# EAGLE board oresat-card (EAGLE 9.3.0)
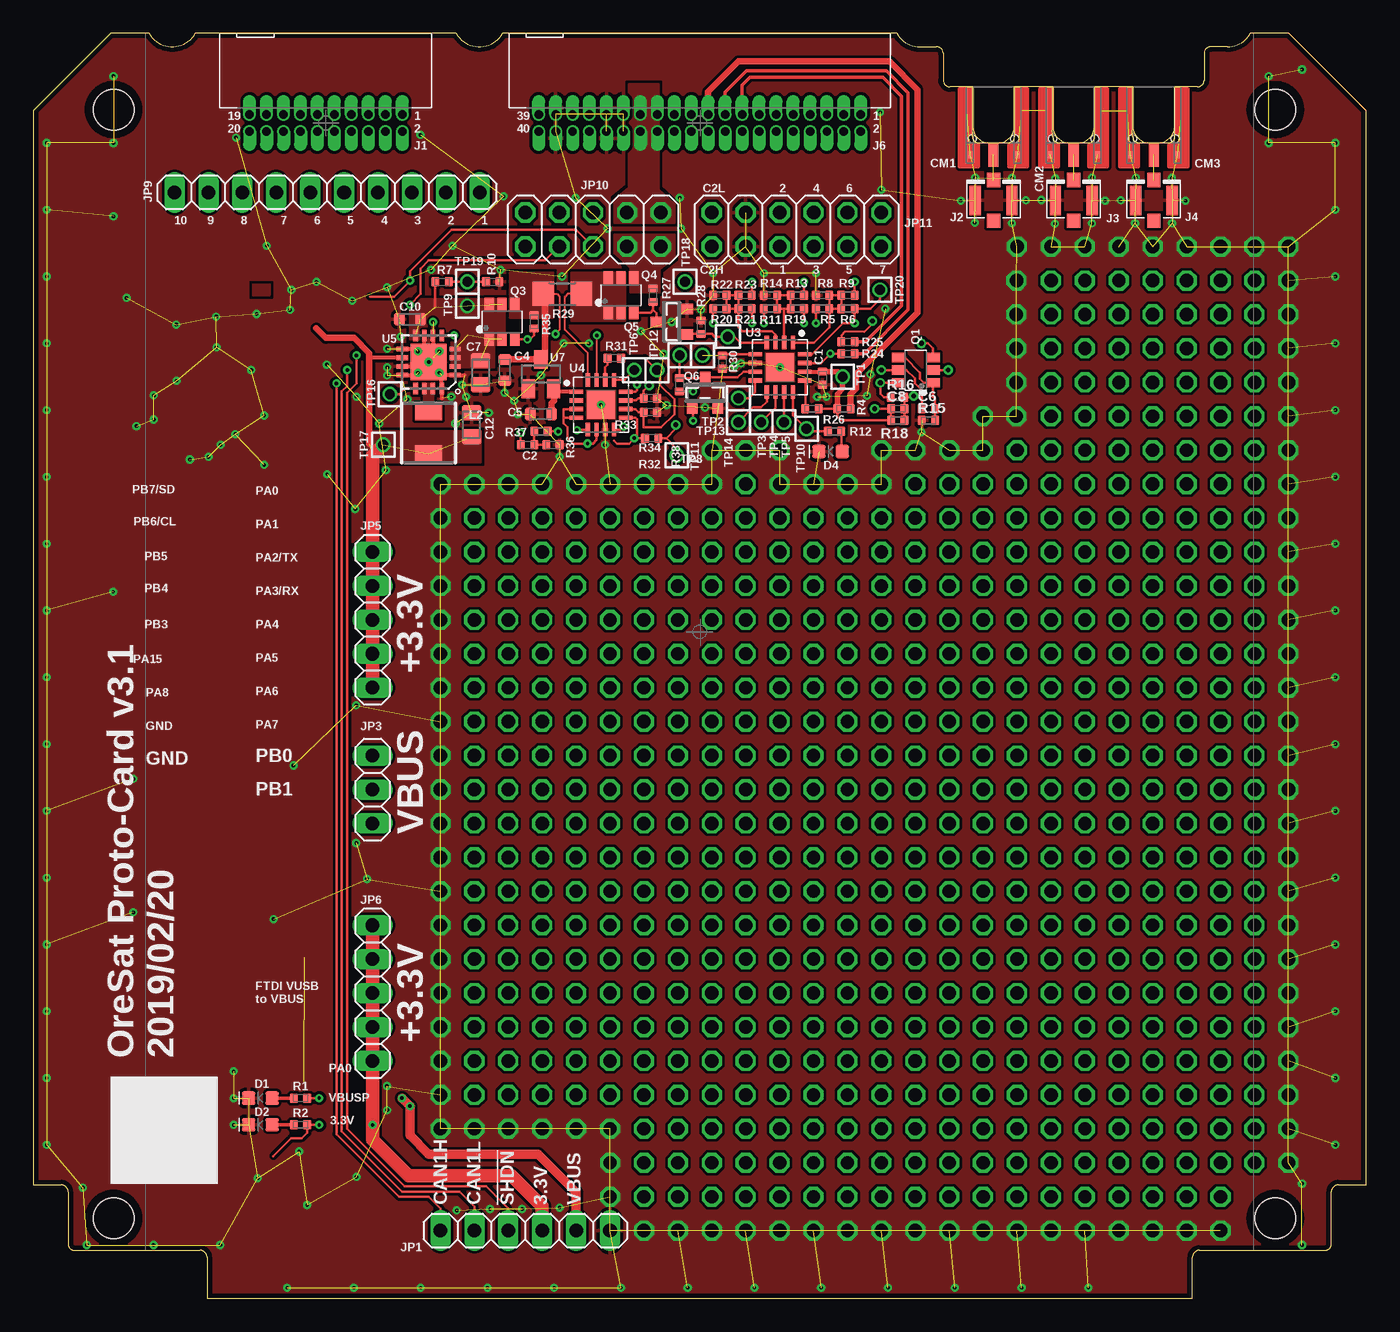
[diagram p2: board, top side]
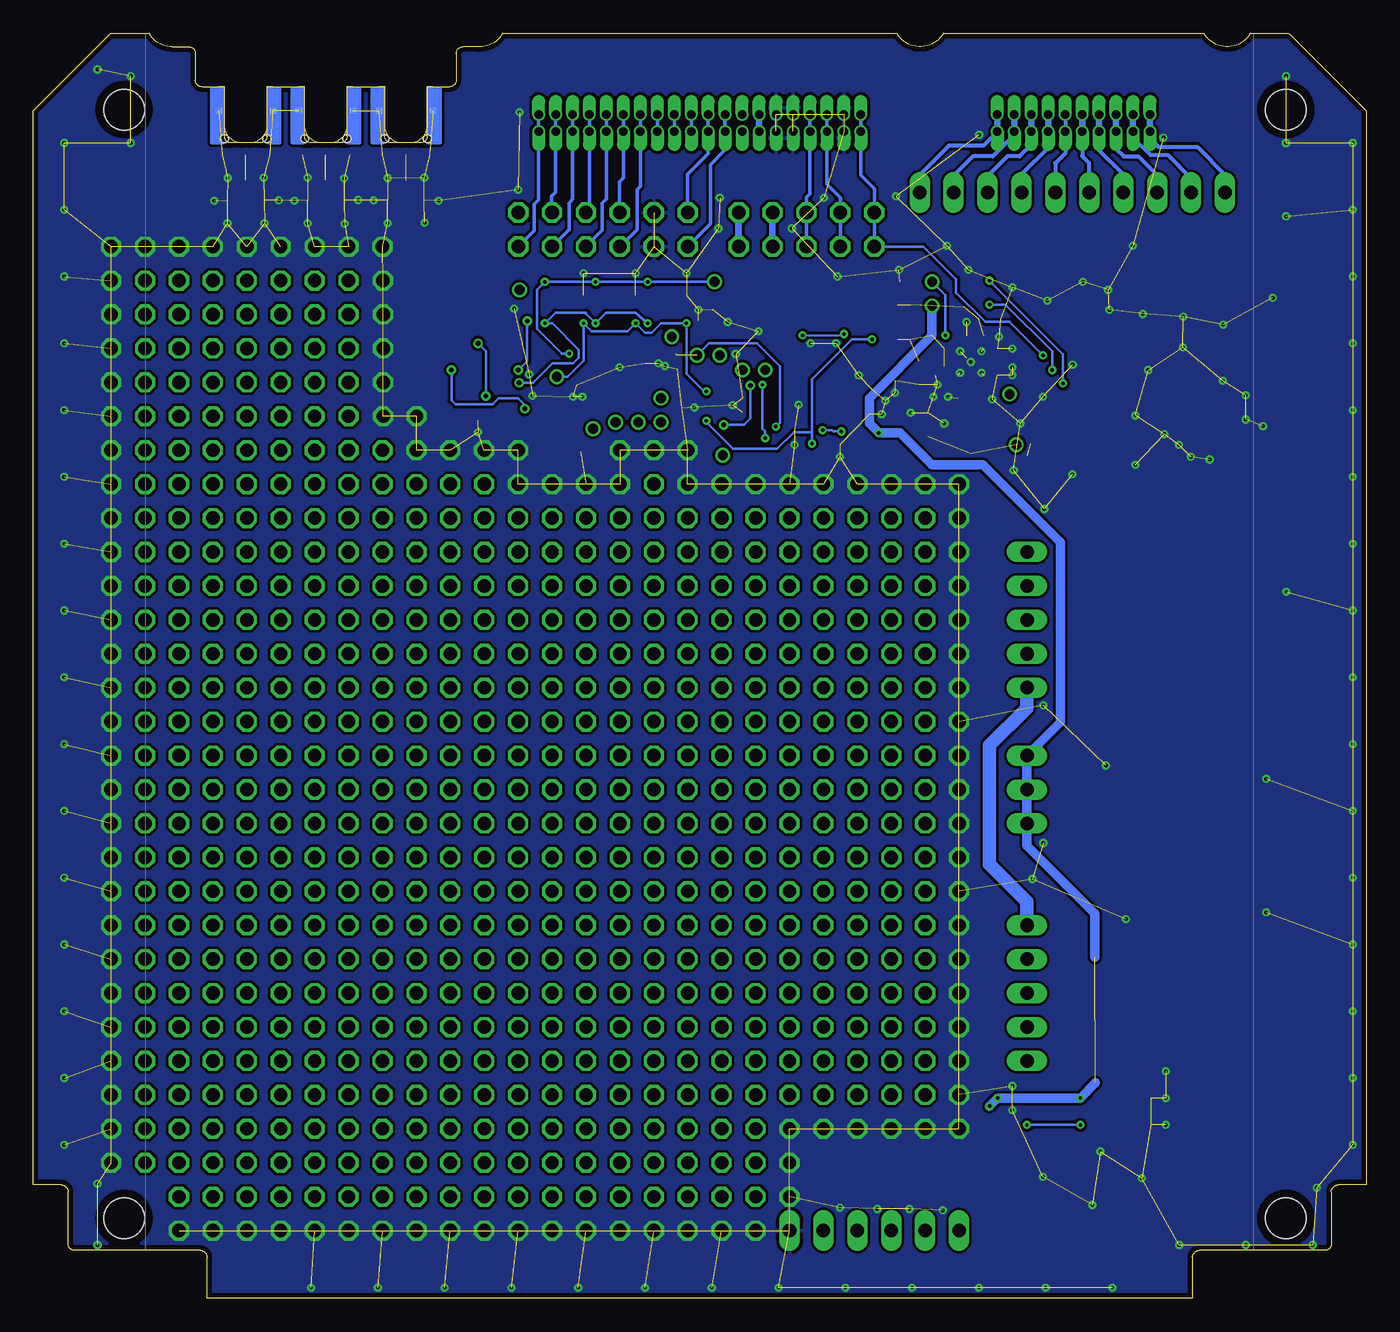
[diagram p3: board, bottom side, seen from below]

Size 99.8 x 94.7 mm. Coordinates in mm from the lower left corner, seen from the top.
Copper layers (1*16): Top 0.0356mm / dielectric 1.5011mm / Bottom 0.0356mm
Design rules "OSH-Park-2-layer *": minimum track width 6mil, minimum drill 10mil, track to track 6mil, track to pad 6mil, pad to pad 6mil, via to via 6mil, smd to smd 6mil, copper to edge 15mil, drill to drill 6mil, minimum pad ring 7mil, minimum via ring 7mil, stop-mask expansion 3mil, vias tented up to drill 13mil, thermal gap 10mil

## Footprints (pad centres in the part's own frame; a part is rotated, then mirrored left to right if it is on the bottom)
.0402-B-NOSILK = smd 0.6 x 0.7: 1 -0.5,0; 2 0.5,0
.0603-B-NOSILK = smd 0.8 x 0.95: 1 -0.8,0; 2 0.8,0
.0805-B-NOSILK = smd 1.15 x 1.45: 1 -0.9,0; 2 0.9,0
J-MOLEX-SMPM-073300-003X = smd 0.508 x 0.508: P$1 -1.778,-5.08; P$2 1.778,-5.08 | smd 0.508 x 0.508 bottom: P$3 -2.032,-1.778; P$4 2.032,-1.778 | smd 0.762 x 1.778: RF 0,-5.08 | hole 0.61: 1.587,-3.886; -1.587,-3.886
LED-0603 = smd 1 x 1: A -0.877,0; C 0.877,0
STAND-OFF-TIGHT = hole 3.048: 0,0
J-SAMTEC-TFM-110-X1-XXX-D-RA = drill 0.635 pad 0.965 offset: 1 5.715,0.635; 2 5.715,-0.635; 3 4.445,0.635; 4 4.445,-0.635; 5 3.175,0.635; 6 3.175,-0.635; 7 1.905,0.635; 8 1.905,-0.635; 9 0.635,0.635; 10 0.635,-0.635; 11 -0.635,0.635; 12 -0.635,-0.635; 13 -1.905,0.635; 14 -1.905,-0.635; 15 -3.175,0.635; 16 -3.175,-0.635; 17 -4.445,0.635; 18 -4.445,-0.635; 19 -5.715,0.635; 20 -5.715,-0.635
U.FL = smd 2.2 x 0.85: 1 0,1.375; 2 0,-1.375 | smd 1.05 x 1: FEED 1.525,0; NC -1.525,0
J-SAMTEC-TFM-120-X1-XXX-D-RA = drill 0.635 pad 0.965 offset: 1 12.065,0.635; 2 12.065,-0.635; 3 10.795,0.635; 4 10.795,-0.635; 5 9.525,0.635; 6 9.525,-0.635; 7 8.255,0.635; 8 8.255,-0.635; 9 6.985,0.635; 10 6.985,-0.635; 11 5.715,0.635; 12 5.715,-0.635; 13 4.445,0.635; 14 4.445,-0.635; 15 3.175,0.635; 16 3.175,-0.635; 17 1.905,0.635; 18 1.905,-0.635; 19 0.635,0.635; 20 0.635,-0.635; 21 -0.635,0.635; 22 -0.635,-0.635; 23 -1.905,0.635; 24 -1.905,-0.635; 25 -3.175,0.635; 26 -3.175,-0.635; 27 -4.445,0.635; 28 -4.445,-0.635; 29 -5.715,0.635; 30 -5.715,-0.635; 31 -6.985,0.635; 32 -6.985,-0.635; 33 -8.255,0.635; 34 -8.255,-0.635; 35 -9.525,0.635; 36 -9.525,-0.635; 37 -10.795,0.635; 38 -10.795,-0.635; 39 -12.065,0.635; 40 -12.065,-0.635
1X06 = drill 1.016 long: 1 -6.35,0; 2 -3.81,0; 3 -1.27,0; 4 1.27,0; 5 3.81,0; 6 6.35,0
1X03 = drill 1.016 long: 1 -2.54,0; 2 0,0; 3 2.54,0
1X05 = drill 1.016 long: 1 -5.08,0; 2 -2.54,0; 3 0,0; 4 2.54,0; 5 5.08,0
1X10 = drill 1.016 long: 1 -11.43,0; 2 -8.89,0; 3 -6.35,0; 4 -3.81,0; 5 -1.27,0; 6 1.27,0; 7 3.81,0; 8 6.35,0; 9 8.89,0; 10 11.43,0
2X05 = drill 1.016 octagon: 1 -5.08,-1.27; 2 -5.08,1.27; 3 -2.54,-1.27; 4 -2.54,1.27; 5 0,-1.27; 6 0,1.27; 7 2.54,-1.27; 8 2.54,1.27; 9 5.08,-1.27; 10 5.08,1.27
2X06 = drill 1.016 octagon: 1 -6.35,-1.27; 2 -6.35,1.27; 3 -3.81,-1.27; 4 -3.81,1.27; 5 -1.27,-1.27; 6 -1.27,1.27; 7 1.27,-1.27; 8 1.27,1.27; 9 3.81,-1.27; 10 3.81,1.27; 11 6.35,-1.27; 12 6.35,1.27
ECS-MPI4040 = smd 2 x 1.3: 1 0,1.575; 2 0,-1.575
SOT23-6 = smd 0.7 x 1: 1 -0.95,-1.3; 2 0,-1.3; 3 0.95,-1.3; 4 0.95,1.3; 5 0,1.3; 6 -0.95,1.3
SOT23 = smd 0.787 x 0.889: 1 -0.953,-1.143; 2 0.953,-1.143; 3 0,1.143
R1206 = smd 1.6 x 1.803: 1 -1.422,0; 2 1.422,0
2MM-TEST-POINT = drill 0.737: 1 0,0
QFN65P400X400X80-17T210 = smd 1.01 x 0.32: 1 -1.86,0.975; 2 -1.86,0.325; 3 -1.86,-0.325; 4 -1.86,-0.975; 9 1.86,-0.975; 10 1.86,-0.325; 11 1.86,0.325; 12 1.86,0.975 | smd 0.32 x 1.01: 5 -0.975,-1.86; 6 -0.325,-1.86; 7 0.325,-1.86; 8 0.975,-1.86; 13 0.975,1.86; 14 0.325,1.86; 15 -0.325,1.86; 16 -0.975,1.86 | smd 2.1 x 2.1: EPAD 0,0
S-PVQFN-16 = smd 0.85 x 0.35: 1 -1.975,0.975; 2 -1.975,0.325; 3 -1.975,-0.325; 4 -1.975,-0.975; 9 1.975,-0.975; 10 1.975,-0.325; 11 1.975,0.325; 12 1.975,0.975 | smd 0.35 x 0.85: 5 -0.975,-1.975; 6 -0.325,-1.975; 7 0.325,-1.975; 8 0.975,-1.975; 13 0.975,1.975; 14 0.325,1.975; 15 -0.325,1.975; 16 -0.975,1.975 | smd 2.7 x 2.7: PAD 0,0
SOT23' = smd 1 x 1.4: 1 -0.95,-1.1; 2 0.95,-1.1; 3 0,1.1

## Placement (x,y rotation side)
C1  100n  [.0402-B-NOSILK]  59.1,68.9 90 top
C2  NP  [.0402-B-NOSILK]  37,63.9 180 top
C4  1u  [.0603-B-NOSILK]  35.3,69.5 270 top
C5  1u  [.0603-B-NOSILK]  38,66.2 180 top
C6  TBD  [.0402-B-NOSILK]  67.03,66.6 0 top
C7  10u  [.0805-B-NOSILK]  33.5,69.3 270 top
C8  TBD  [.0402-B-NOSILK]  64.72,66.6 0 top
C10  1u  [.0603-B-NOSILK]  28.2,73.3 180 top
C12  22u  [.0805-B-NOSILK]  32.8,65.4 90 top
CM1  J-MOLEX-SMPM-73300-003X  [J-MOLEX-SMPM-073300-003X]  71.9,90.7 0 top
CM2  J-MOLEX-SMPM-73300-003X  [J-MOLEX-SMPM-073300-003X]  77.9,90.7 0 top
CM3  J-MOLEX-SMPM-73300-003X  [J-MOLEX-SMPM-073300-003X]  83.9,90.7 0 top
D1  GREEN  [LED-0603]  17,15 180 top
D2  GREEN  [LED-0603]  17,13 180 top
D4  AMBER  [LED-0603]  59.7,63.4 180 top
H1  STAND-OFFTIGHT  [STAND-OFF-TIGHT]  93,6 0 top
H2  STAND-OFFTIGHT  [STAND-OFF-TIGHT]  93,89 0 top
H3  STAND-OFFTIGHT  [STAND-OFF-TIGHT]  6,89 0 top
H4  STAND-OFFTIGHT  [STAND-OFF-TIGHT]  6,6 0 top
J1  J-SAMTEC-TFM-110-X1-XXX-D-RA  [J-SAMTEC-TFM-110-X1-XXX-D-RA]  21.9,87.99 0 top
J2  U.FL  [U.FL]  71.9,82.2 90 top
J3  U.FL  [U.FL]  77.9,82.2 90 top
J4  U.FL  [U.FL]  83.9,82.2 90 top
J6  J-SAMTEC-TFM-120-X1-XXX-D-RA  [J-SAMTEC-TFM-120-X1-XXX-D-RA]  49.9,87.99 0 top
JP1  [1X06]  36.83,5.08 0 top
JP3  [1X03]  25.4,38.1 90 top
JP5  [1X05]  25.4,50.8 270 top
JP6  [1X05]  25.4,22.86 90 top
JP9  [1X10]  22,82.8 180 top
JP10  [2X05]  41.91,80.01 180 top
JP11  [2X06]  57.15,80.01 180 top
L2  6.8u  [ECS-MPI4040]  29.6,64.8 0 top
Q1  DMP2240UDM  [SOT23-6]  66.08,69.5 90 top
Q3  MOSFET-PCH-SOT23-6  [SOT23-6]  35.1,73.1 0 top
Q4  MOSFET-PCH-SOT23-6  [SOT23-6]  44,75.1 0 top
Q5  PMV45EN  [SOT23]  47.8,73.1 90 top
Q6  PMV45EN  [SOT23]  50.3,67.8 0 top
R1  2.7k  [.0402-B-NOSILK]  20,15 0 top
R2  2.7k  [.0402-B-NOSILK]  20,13 0 top
R4  100  [.0402-B-NOSILK]  60.7,66.6 180 top
R5  NP  [.0402-B-NOSILK]  59.1,74.1 180 top
R6  NP  [.0402-B-NOSILK]  61,75.1 180 top
R7  10k  [.0402-B-NOSILK]  30.6,76.1 180 top
R8  NP  [.0402-B-NOSILK]  59.1,75.1 0 top
R9  NP  [.0402-B-NOSILK]  61,74.1 0 top
R10  NP  [.0402-B-NOSILK]  34.4,76.1 180 top
R11  NP  [.0402-B-NOSILK]  55.2,74.1 180 top
R12  2.7k  [.0402-B-NOSILK]  60,64.9 180 top
R13  NP  [.0402-B-NOSILK]  57.2,75.1 180 top
R14  NP  [.0402-B-NOSILK]  55.2,75.1 0 top
R15  10k  [.0402-B-NOSILK]  67.03,65.72 0 top
R16  10k  [.0402-B-NOSILK]  64.7,67.47 0 top
R18  10k  [.0402-B-NOSILK]  64.72,65.72 180 top
R19  NP  [.0402-B-NOSILK]  57.2,74.1 0 top
R20  NP  [.0402-B-NOSILK]  51.4,74.1 180 top
R21  NP  [.0402-B-NOSILK]  53.3,75.1 180 top
R22  NP  [.0402-B-NOSILK]  51.4,75.1 0 top
R23  NP  [.0402-B-NOSILK]  53.3,74.1 0 top
R24  100  [.0402-B-NOSILK]  61,70.72 180 top
R25  100  [.0402-B-NOSILK]  61,71.6 180 top
R26  10k  [.0402-B-NOSILK]  58.3,66.6 0 top
R27  10k  [.0402-B-NOSILK]  46.4,75.1 90 top
R28  10k  [.0402-B-NOSILK]  50,72.7 270 top
R29  100m  [R1206]  39.6,75.2 180 top
R30  10k  [.0402-B-NOSILK]  51.6,70.1 90 top
R31  0  [.0402-B-NOSILK]  43.5,70.4 180 top
R32  NP  [.0402-B-NOSILK]  46.2,66.35 180 top
R33  0  [.0402-B-NOSILK]  46.3,64.4 180 top
R34  NP  [.0402-B-NOSILK]  46.2,67.4 180 top
R35  10k  [.0402-B-NOSILK]  37.5,73.1 90 top
R36  NP  [.0402-B-NOSILK]  38.9,63.9 180 top
R37  NP  [.0402-B-NOSILK]  38,64.9 180 top
R38  10k  [.0402-B-NOSILK]  48.4,68.4 270 top
TP1  TEST-POINT  [2MM-TEST-POINT]  60.6,69 0 top
TP2  TEST-POINT  [2MM-TEST-POINT]  52.8,67.4 0 top
TP3  TEST-POINT  [2MM-TEST-POINT]  52.8,65.6 0 top
TP4  TEST-POINT  [2MM-TEST-POINT]  54.5,65.6 0 top
TP5  TEST-POINT  [2MM-TEST-POINT]  56.2,65.6 0 top
TP6  TEST-POINT  [2MM-TEST-POINT]  45,69.5 0 top
TP8  TEST-POINT  [2MM-TEST-POINT]  48.4,70.6 0 top
TP9  TEST-POINT  [2MM-TEST-POINT]  32.5,74.3 0 top
TP10  TEST-POINT  [2MM-TEST-POINT]  57.9,65.1 0 top
TP11  TEST-POINT  [2MM-TEST-POINT]  48.17,63.13 0 top
TP12  TEST-POINT  [2MM-TEST-POINT]  46.7,69.5 0 top
TP13  TEST-POINT  [2MM-TEST-POINT]  52,72 90 top
TP14  TEST-POINT  [2MM-TEST-POINT]  50.1,70.6 0 top
TP16  TEST-POINT  [2MM-TEST-POINT]  26.7,67.7 180 top
TP17  TEST-POINT  [2MM-TEST-POINT]  26.2,63.9 180 top
TP18  TEST-POINT  [2MM-TEST-POINT]  48.8,76.1 0 top
TP19  TEST-POINT  [2MM-TEST-POINT]  32.5,76.1 0 top
TP20  TEST-POINT  [2MM-TEST-POINT]  63.4,75.5 0 top
U3  MAX7310ATE  [QFN65P400X400X80-17T210]  55.9,69.7 270 top
U4  MAX4211CETE  [QFN65P400X400X80-17T210]  42.5,66.9 0 top
U5  TPS62111RSA  [S-PVQFN-16]  29.6,70.1 180 top
U7  MCP1703A  [SOT23']  38,69.2 0 top
U$1  ORESAT-CARD-V1.1-3XRF  [ORESAT-CARD-V1.1-3XRF]  0,0 0 top

## Tracks (layer width: path | path; a pad name or v marks a point on that pad's centre or on a via)
3.3V  (via drill 0.25)  (3 unrouted)
  Top 0.2: v21.4,13 R2.2 20.5,12.4 20.1,12 19.3,12 17.96,10.66
  Top 0.3: U5.10 25.18,70.42 25.15,70.5
  Top 0.5: 21.18,72.62 21.9,71.9 24,71.9 25.15,70.75 25.15,70.5 25.15,64
  Top 1: JP5.5 JP5.4 JP5.3 JP5.2 JP5.1 25.4,63.1 TP17.1 | JP6.5 JP6.4 JP6.3 JP6.2 JP6.1 v25.4,13 25.4,11.9 28.1,9.2 35.8,9.2 38.1,6.9 JP1.4
  Bottom 0.2: v21.4,13 v25.4,13
  Bottom 1: JP5.5 25.4,44.2 28.2,41.4 28.2,32.5 25.4,29.7 JP6.5
  pour Top (no thermals): 16.42,75.9 16.42,75.1 17.72,75.1 17.72,75.9
  pour Top (no thermals): 25,64.9 33.5,64.9 33.5,62.6 25,62.6
!FAULT
  Top 0.2: U3.7 53.17,69.38 52.74,68.94 Q6.3 50.26,68.9 R38.1 TP8.1
!SHUTDOWN  (via drill 0.25)
  Top 0.2: v24.2,70.6 24.2,68.5 23.5,67.8 23.5,12.7 27.8,8.4 33.9,8.4 35.56,6.74 JP1.3
  Bottom 0.2: v24.2,70.6 26.7,73.1 28.5,73.1 30.7,75.3 30.7,76.3 33.14,78.74 JP10.10
  Bottom 0.25: J6.39 J6.40 37.84,84.06 36.83,83.06 JP10.9 JP10.10
AD0
  Top 0.2: U3.1 58.46,71.56 59.6,72.7 R5.1 | R5.1 R9.1 R6.2 R8.2 R5.1
AD1
  Top 0.2: U3.2 56.23,72.44 56.2,72.47 56.2,74.1 | 56.2,74.1 R11.1 R14.2 R13.2 R19.1 56.2,74.1
AD2
  Top 0.2: U3.3 55.58,72.12 55.3,72.4 53.1,72.4 52.8,72.7 R23.1 | R23.1 R21.2 R22.2 R20.1 R23.1
AUX_!SHUTDOWN
  Bottom 0.3: J1.20 16.18,86.83 15.55,86.2 12.65,86.2 10.55,84.1 10.57,84.08 JP9.10
  Bottom 0.5: J1.20 J1.19
AUX_CAN1_H
  Bottom 0.3: J1.14 20,85.94 18.19,84.14 JP9.7
  Bottom 0.5: J1.14 J1.13
AUX_CAN1_L
  Bottom 0.3: J1.16 18.73,86.08 18.15,85.5 17.05,85.5 15.65,84.1 JP9.8
  Bottom 0.5: J1.16 J1.15
AUX_CAN2_H
  Bottom 0.3: J1.2 27.61,87.33 28.65,86.3 31.25,86.3 33.45,84.1 33.45,83.32 JP9.1
  Bottom 0.5: J1.2 J1.1
AUX_CAN2_L
  Bottom 0.3: J1.4 26.34,87.11 27.95,85.5 29.45,85.5 30.95,84 30.89,83.94 JP9.2
  Bottom 0.5: J1.4 J1.3
AUX_GND1
  Bottom 0.3: J1.18 17.45,86.91 16.15,85.6 14.85,85.6 13.11,83.86 JP9.9
  Bottom 0.5: J1.18 J1.17
AUX_GND2
  Bottom 0.3: J1.12 21.27,85.52 20.75,85 20.75,83.32 JP9.6
  Bottom 0.5: J1.12 J1.11
AUX_GND3
  Bottom 0.3: JP9.5 23.27,84.98 22.54,85.72 J1.10 J1.9
AUX_VBUS1
  Bottom 0.3: J1.8 23.8,86.14 25.81,84.14 JP9.4
  Bottom 0.5: J1.8 J1.7
AUX_VBUS2
  Bottom 0.3: J1.6 25.07,86.38 25.95,85.5 26.85,85.5 28.35,84 JP9.3
  Bottom 0.5: J1.6 J1.5
CAN1_H  (via drill 0.25)
  Top 0.2: JP10.6 40.65,80 31.3,80 28.2,76.9 v28.2,76.2 27,75 25.2,75 | JP1.1 30.5,5.1 30.5,6.7 29.6,7.6 27.4,7.6 22.7,12.3 v22.7,68.5
  Bottom 0.2: v28.2,76.2 22.7,70.7 v22.7,68.5
  Bottom 0.25: J6.33 J6.34 41.65,82.69 41.9,82.43 JP10.5 JP10.6
CAN1_L  (via drill 0.25)
  Top 0.2: JP10.8 38.33,77.7 29.6,77.7 29,77.1 29,75.2 v28.2,74.4 28.18,74.38 | v23.5,69.5 23.5,68.3 23.1,67.9 23.1,12.5 27.6,8 31.9,8 33.02,6.88 JP1.2
  Bottom 0.2: v28.2,74.4 27,74.4 23.5,70.9 v23.5,69.5
  Bottom 0.25: J6.35 J6.36 40.38,83.41 39.37,82.4 JP10.7 JP10.8
CAN2_H
  Bottom 0.25: J6.21 J6.22 49.27,85.7 50.8,84.17 JP11.11
CAN2_L
  Bottom 0.25: J6.23 J6.24 47.99,85.97 49.1,84.87 49.1,80.44 JP11.12
CB-RESET  (via drill 0.25)  (2 unrouted)
  Top 0.2: U3.5 51.67,70.67 | v44.2,65.26 43.98,65.04 U4.8
  Bottom 0.2: v44.2,65.26 43.9,65.56 43.9,69.8 45.6,71.5 49.2,71.5 TP14.1
CB_CTRL  (via drill 0.25)
  Top 0.2: R35.1 37.5,72.1 37.2,71.8 v37,71.8 Q3.3 | U4.6 42.17,64.28 41.9,64 v41.5,64 40.4,64 40,64.4 40,65.22 39.7,65.53 39.7,65.92 | U4.4 39.7,65.92 | U4.3 39.7,66.58 39.7,65.92 | v49.4,65.7 49.4,66.61 Q6.1
  Bottom 0.2: v41.5,64 41.5,64.9 | 41.5,64.9 41.5,68.8 38.5,71.8 v37,71.8 | v49.4,65.7 49.4,65.6 47.4,63.6 44.1,63.6 42.85,64.85 41.55,64.85 41.5,64.9
GND  (via drill 0.25, 1)  (336 unrouted)
  Top 0.3: 30.57,69.12 U5.16 30.57,67.38 | 30.57,69.12 U5.1 32.27,69.12 | 30.57,69.12 U5.PAD | U5.6 29.93,70.42 U5.PAD | U5.7 29.27,70.42 U5.PAD | U5.9 28.62,71.08 U5.PAD | U5.11 29.27,69.78 U5.PAD | U5.12 28.62,69.12 U5.PAD
  other vias: 13.72,71.2 21.2,76.1 16.32,69.5 19.32,75.5 7.72,65.3 4,4 23.88,74.7 97.5,11.5 1,11.5 1,16.5 1,21.5 1,26.5 1,31.5 1,36.5 1,41.5 1,46.5 1,51.5 1,56.5 1,61.5 1,66.5 1,71.5 1,76.5 1,81.5 1,86.5 6,86.5 6,91.5 97.5,16.5 97.5,21.5 97.5,26.5 97.5,31.5 97.5,36.5 97.5,41.5 97.5,46.5 97.5,51.5 97.5,56.5 97.5,61.5 97.5,66.5 97.5,71.5 97.5,76.5 97.5,81.5 97.5,86.5 92.5,86.5 92.5,91.5 30.48,53.34 30.48,55.88 30.48,48.26 30.48,45.72 30.48,43.18 30.48,40.64 30.48,38.1 30.48,35.56 30.48,33.02 30.48,30.48 30.48,27.94 30.48,25.4 30.48,22.86 30.48,20.32 30.48,17.78 30.48,15.24 30.48,12.7 33.02,12.7 53.34,5.08 55.88,5.08 58.42,5.08 60.96,5.08 63.5,5.08 66.04,5.08 68.58,5.08 71.12,5.08 73.66,5.08 76.2,5.08 78.74,5.08 81.28,5.08 83.82,5.08 86.36,5.08 88.9,5.08 19.22,74 15.12,64.7 14.02,63.9 13.12,63 11.72,62.8 9.02,65.8 9.02,67.6 10.72,68.7 16.72,73.7 95,8.6 95,4 3.7,8.3 9,4 93.98,50.8 93.98,48.26 93.98,45.72 93.98,43.18 93.98,40.64 93.98,38.1 93.98,35.56 93.98,33.02 93.98,30.48 93.98,27.94 93.98,25.4 93.98,22.86 93.98,20.32 93.98,17.78 93.98,15.24 93.98,12.7 93.98,10.16 35.56,12.7 30.48,50.8 14,4 19,0.8 24,0.8 29,0.8 39,0.8 44,0.8 49,0.8 54,0.8 59,0.8 64,0.8 69,0.8 74,0.8 13.7,73.5 10.7,72.9 93.98,53.34 93.98,55.88 93.98,58.42 93.98,60.96 93.98,63.5 93.98,66.04 93.98,68.58 93.98,71.12 93.98,73.66 93.98,76.2 93.98,78.74 91.44,78.74 88.9,78.74 86.36,78.74 83.82,78.74 81.28,78.74 78.74,78.74 76.2,78.74 73.66,78.74 50.8,63.5 38.1,12.7 40.64,12.7 45.72,5.08 48.26,5.08 50.8,5.08 45.72,60.96 43.18,60.96 40.64,60.96 38.1,60.96 43.18,12.7 43.18,10.16 43.18,7.62 21.98,69.9 6.98,74.9 5.98,52.9 19.48,39.9 7.48,38.9 7.48,28.9 17.98,28.4 24.98,31.4 16.8,9 19.9,11 26.5,14.1 26.5,69.1 26.5,69.7 27.5,72 26.5,71.1 29.6,70.1 30.4,69.3 28.8,69.3 28.8,70.9 30.4,70.9 32.1,68.4 31.3,67.5 32.4,67.5 34.1,66.3 53,70 55.9,69.7 58.7,67.5 59.4,67.5 35.28,67.8 36.28,66.2 39.4,63 42.5,66.9 42.8,63.9 50.3,66.7 47.42,66.88 47.8,73.1 50,74 52.5,69.8 45.5,72.4 47.2,70.7 34.98,77 28,67.3 35.56,60.96 33.02,60.96 30.48,60.96 30.48,58.42 39.6,76.5 40.6,82.4 35.2,82.5 43,80.1 48.5,80.1 48.4,82.4 63.4,88.8 63.8,74.1 63.5,83 41.6,71.5 39.7,71.5 38,69.1 36,67.2 31.6,65.5 25.9,65.5 26.4,62 24.2,67.5 24.1,59.1 22,61.7 17.28,66.1 17.28,62.4 24.18,44.4 24.18,34.1 26.48,15.9 39.4,6.8 36.6,6.7 34.2,6.7 31.7,6.6 34,0.8 79,0.8 95,92 29.78,77 31.38,78.8 26.48,75.7 17.48,78.8 15.18,86.9 28.98,87.1 6,81 20.5,7 15,13 15,15 15,17 24.2,9.1 48.26,60.96 53.34,63.5 66.5,64.85 62.67,69.17 62.42,67.58 73.62,76.2 73.61,66.04 73.61,68.58 73.61,71.12 73.61,73.66 55.88,63.5 55.88,60.96 58.42,60.96 60.96,60.96 63.5,60.96 63.5,63.5 66.04,63.5 50.8,60.96 68.58,63.5 71.11,66.04 71.12,63.5 50.9,76.75 54.7,76.75 58.6,76.75 29.93,73.1 86.28,82.17 85.28,80.47 85.25,83.88 82.55,83.9 81.42,82.2 82.5,80.47 80.25,82.17 79.28,83.9 79.28,80.47 76.5,80.45 75.47,82.22 76.53,83.85 73.28,83.88 74.33,82.2 73.28,80.5 70.5,80.53 69.45,82.17 70.53,83.9
  pour Top (isolate 0.2, rank 6): 0,0 101,0 101,95.3 0,95.3
  pour Bottom (isolate 0.2, rank 6): 0,0 100,0 100,95 0,95
MAX4211-3V3
  Top 0.3: U4.1 39.17,67.88 U7.2
  Top 0.5: C5.1 38.8,67 39,67.2 39,68.05 U7.2
N$2  (via drill 1)
  other vias: 38.1,50.8
N$3  (via drill 1)
  other vias: 40.64,50.8
N$4  (via drill 1)
  other vias: 50.8,7.62
N$5  (via drill 1)
  other vias: 53.34,7.62
N$6  (via drill 1)
  other vias: 55.88,7.62
N$7  (via drill 1)
  other vias: 58.42,7.62
N$8  (via drill 1)
  other vias: 60.96,7.62
N$9  (via drill 1)
  other vias: 43.18,50.8
N$10  (via drill 1)
  other vias: 50.8,10.16
N$11  (via drill 1)
  other vias: 53.34,10.16
N$12  (via drill 1)
  other vias: 55.88,10.16
N$13  (via drill 1)
  other vias: 45.72,50.8
N$14  (via drill 1)
  other vias: 48.26,50.8
N$15  (via drill 1)
  other vias: 50.8,12.7
N$16  (via drill 1)
  other vias: 53.34,12.7
N$17  (via drill 1)
  other vias: 38.1,48.26
N$18  (via drill 1)
  other vias: 50.8,15.24
N$19  (via drill 1)
  other vias: 40.64,48.26
N$20  (via drill 1)
  other vias: 43.18,48.26
N$21  (via drill 1)
  other vias: 45.72,48.26
N$22  (via drill 1)
  other vias: 48.26,48.26
N$23  (via drill 1)
  other vias: 38.1,45.72
N$24  (via drill 1)
  other vias: 40.64,45.72
N$25  (via drill 1)
  other vias: 43.18,45.72
N$26  (via drill 1)
  other vias: 45.72,45.72
N$27  (via drill 1)
  other vias: 48.26,45.72
N$28  (via drill 1)
  other vias: 38.1,43.18
N$29  (via drill 1)
  other vias: 40.64,43.18
N$30  (via drill 1)
  other vias: 43.18,43.18
N$31  (via drill 1)
  other vias: 45.72,43.18
N$32  (via drill 1)
  other vias: 81.28,50.8
N$33  (via drill 1)
  other vias: 81.28,48.26
N$34  (via drill 1)
  other vias: 81.28,45.72
N$35  (via drill 1)
  other vias: 81.28,43.18
N$36  (via drill 1)
  other vias: 81.28,40.64
N$37  (via drill 1)
  other vias: 81.28,38.1
N$38  (via drill 1)
  other vias: 48.26,43.18
N$39  (via drill 1)
  other vias: 38.1,40.64
N$40  (via drill 1)
  other vias: 40.64,40.64
N$41  (via drill 1)
  other vias: 43.18,40.64
N$42  (via drill 1)
  other vias: 45.72,40.64
N$43  (via drill 1)
  other vias: 48.26,40.64
N$44  (via drill 1)
  other vias: 38.1,38.1
N$45  (via drill 1)
  other vias: 40.64,38.1
N$46  (via drill 1)
  other vias: 43.18,38.1
N$47  (via drill 1)
  other vias: 45.72,38.1
N$48  (via drill 1)
  other vias: 48.26,38.1
N$49  (via drill 1)
  other vias: 38.1,35.56
N$50  (via drill 1)
  other vias: 40.64,35.56
N$51  (via drill 1)
  other vias: 43.18,35.56
N$52  (via drill 1)
  other vias: 50.8,50.8
N$53  (via drill 1)
  other vias: 53.34,50.8
N$54  (via drill 1)
  other vias: 55.88,50.8
N$55  (via drill 1)
  other vias: 58.42,50.8
N$56  (via drill 1)
  other vias: 60.96,50.8
N$57  (via drill 1)
  other vias: 63.5,50.8
N$58  (via drill 1)
  other vias: 66.04,50.8
N$59  (via drill 1)
  other vias: 68.58,50.8
N$60  (via drill 1)
  other vias: 71.12,50.8
N$61  (via drill 1)
  other vias: 73.66,50.8
N$62  (via drill 1)
  other vias: 76.2,50.8
N$63  (via drill 1)
  other vias: 78.74,50.8
N$64  (via drill 1)
  other vias: 45.72,35.56
N$65  (via drill 1)
  other vias: 50.8,48.26
N$66  (via drill 1)
  other vias: 53.34,48.26
N$67  (via drill 1)
  other vias: 55.88,48.26
N$68  (via drill 1)
  other vias: 58.42,48.26
N$69  (via drill 1)
  other vias: 60.96,48.26
N$70  (via drill 1)
  other vias: 63.5,48.26
N$71  (via drill 1)
  other vias: 66.04,48.26
N$72  (via drill 1)
  other vias: 68.58,48.26
N$73  (via drill 1)
  other vias: 71.12,48.26
N$74  (via drill 1)
  other vias: 73.66,48.26
N$75  (via drill 1)
  other vias: 76.2,48.26
N$76  (via drill 1)
  other vias: 78.74,48.26
N$77  (via drill 1)
  other vias: 48.26,35.56
N$78  (via drill 1)
  other vias: 50.8,45.72
N$79  (via drill 1)
  other vias: 53.34,45.72
N$80  (via drill 1)
  other vias: 55.88,45.72
N$81  (via drill 1)
  other vias: 58.42,45.72
N$82  (via drill 1)
  other vias: 60.96,45.72
N$83  (via drill 1)
  other vias: 63.5,45.72
N$84  (via drill 1)
  other vias: 66.04,45.72
N$85  (via drill 1)
  other vias: 68.58,45.72
N$86  (via drill 1)
  other vias: 71.12,45.72
N$87  (via drill 1)
  other vias: 73.66,45.72
N$88  (via drill 1)
  other vias: 76.2,45.72
N$89  (via drill 1)
  other vias: 78.74,45.72
N$90  (via drill 1)
  other vias: 38.1,33.02
N$91  (via drill 1)
  other vias: 50.8,43.18
N$92  (via drill 1)
  other vias: 53.34,43.18
N$93  (via drill 1)
  other vias: 55.88,43.18
N$94  (via drill 1)
  other vias: 58.42,43.18
N$95  (via drill 1)
  other vias: 60.96,43.18
N$96  (via drill 1)
  other vias: 63.5,43.18
N$97  (via drill 1)
  other vias: 66.04,43.18
N$98  (via drill 1)
  other vias: 68.58,43.18
N$99  (via drill 1)
  other vias: 71.12,43.18
N$100  (via drill 1)
  other vias: 73.66,43.18
N$101  (via drill 1)
  other vias: 76.2,43.18
N$102  (via drill 1)
  other vias: 78.74,43.18
N$103  (via drill 1)
  other vias: 40.64,33.02
N$104  (via drill 1)
  other vias: 50.8,40.64
N$105  (via drill 1)
  other vias: 53.34,40.64
N$106  (via drill 1)
  other vias: 55.88,40.64
N$107  (via drill 1)
  other vias: 58.42,40.64
N$108  (via drill 1)
  other vias: 60.96,40.64
N$109  (via drill 1)
  other vias: 63.5,40.64
N$110  (via drill 1)
  other vias: 66.04,40.64
N$111  (via drill 1)
  other vias: 68.58,40.64
N$112  (via drill 1)
  other vias: 71.12,40.64
N$113  (via drill 1)
  other vias: 73.66,40.64
N$114  (via drill 1)
  other vias: 76.2,40.64
N$115  (via drill 1)
  other vias: 78.74,40.64
N$116  (via drill 1)
  other vias: 43.18,33.02
N$117  (via drill 1)
  other vias: 50.8,38.1
N$118  (via drill 1)
  other vias: 53.34,38.1
N$119  (via drill 1)
  other vias: 55.88,38.1
N$120  (via drill 1)
  other vias: 58.42,38.1
N$121  (via drill 1)
  other vias: 60.96,38.1
N$122  (via drill 1)
  other vias: 63.5,38.1
N$123  (via drill 1)
  other vias: 66.04,38.1
N$124  (via drill 1)
  other vias: 68.58,38.1
N$125  (via drill 1)
  other vias: 71.12,38.1
N$126  (via drill 1)
  other vias: 73.66,38.1
N$127  (via drill 1)
  other vias: 76.2,38.1
N$128  (via drill 1)
  other vias: 78.74,38.1
N$129  (via drill 1)
  other vias: 45.72,33.02
N$130  (via drill 1)
  other vias: 50.8,35.56
N$131  (via drill 1)
  other vias: 53.34,35.56
N$132  (via drill 1)
  other vias: 55.88,35.56
N$133  (via drill 1)
  other vias: 58.42,35.56
N$134  (via drill 1)
  other vias: 60.96,35.56
N$135  (via drill 1)
  other vias: 63.5,35.56
N$136  (via drill 1)
  other vias: 66.04,35.56
N$137  (via drill 1)
  other vias: 68.58,35.56
N$138  (via drill 1)
  other vias: 71.12,35.56
N$139  (via drill 1)
  other vias: 73.66,35.56
N$140  (via drill 1)
  other vias: 76.2,35.56
N$141  (via drill 1)
  other vias: 78.74,35.56
N$142  (via drill 1)
  other vias: 48.26,33.02
N$143  (via drill 1)
  other vias: 50.8,33.02
N$144  (via drill 1)
  other vias: 53.34,33.02
N$145  (via drill 1)
  other vias: 55.88,33.02
N$146  (via drill 1)
  other vias: 58.42,33.02
N$147  (via drill 1)
  other vias: 60.96,33.02
N$148  (via drill 1)
  other vias: 63.5,33.02
N$149  (via drill 1)
  other vias: 66.04,33.02
N$150  (via drill 1)
  other vias: 68.58,33.02
N$151  (via drill 1)
  other vias: 71.12,33.02
N$152  (via drill 1)
  other vias: 73.66,33.02
N$153  (via drill 1)
  other vias: 76.2,33.02
N$154  (via drill 1)
  other vias: 78.74,33.02
N$155  (via drill 1)
  other vias: 38.1,30.48
N$156  (via drill 1)
  other vias: 50.8,30.48
N$157  (via drill 1)
  other vias: 53.34,30.48
N$158  (via drill 1)
  other vias: 55.88,30.48
N$159  (via drill 1)
  other vias: 58.42,30.48
N$160  (via drill 1)
  other vias: 60.96,30.48
N$161  (via drill 1)
  other vias: 63.5,30.48
N$162  (via drill 1)
  other vias: 66.04,30.48
N$163  (via drill 1)
  other vias: 68.58,30.48
N$164  (via drill 1)
  other vias: 71.12,30.48
N$165  (via drill 1)
  other vias: 73.66,30.48
N$166  (via drill 1)
  other vias: 76.2,30.48
N$167  (via drill 1)
  other vias: 78.74,30.48
N$168  (via drill 1)
  other vias: 40.64,30.48
N$169  (via drill 1)
  other vias: 50.8,27.94
N$170  (via drill 1)
  other vias: 53.34,27.94
N$171  (via drill 1)
  other vias: 55.88,27.94
N$172  (via drill 1)
  other vias: 58.42,27.94
N$173  (via drill 1)
  other vias: 60.96,27.94
N$174  (via drill 1)
  other vias: 63.5,27.94
N$175  (via drill 1)
  other vias: 66.04,27.94
N$176  (via drill 1)
  other vias: 68.58,27.94
N$177  (via drill 1)
  other vias: 71.12,27.94
N$178  (via drill 1)
  other vias: 73.66,27.94
N$179  (via drill 1)
  other vias: 76.2,27.94
N$180  (via drill 1)
  other vias: 78.74,27.94
N$181  (via drill 1)
  other vias: 43.18,30.48
N$182  (via drill 1)
  other vias: 50.8,25.4
N$183  (via drill 1)
  other vias: 53.34,25.4
N$184  (via drill 1)
  other vias: 55.88,25.4
N$185  (via drill 1)
  other vias: 58.42,25.4
N$186  (via drill 1)
  other vias: 60.96,25.4
N$187  (via drill 1)
  other vias: 63.5,25.4
N$188  (via drill 1)
  other vias: 66.04,25.4
N$189  (via drill 1)
  other vias: 68.58,25.4
N$190  (via drill 1)
  other vias: 71.12,25.4
N$191  (via drill 1)
  other vias: 73.66,25.4
N$192  (via drill 1)
  other vias: 76.2,25.4
N$193  (via drill 1)
  other vias: 78.74,25.4
N$194  (via drill 1)
  other vias: 45.72,30.48
N$195  (via drill 1)
  other vias: 50.8,22.86
N$196  (via drill 1)
  other vias: 53.34,22.86
N$197  (via drill 1)
  other vias: 55.88,22.86
N$198  (via drill 1)
  other vias: 58.42,22.86
N$199  (via drill 1)
  other vias: 60.96,22.86
N$200  (via drill 1)
  other vias: 63.5,22.86
N$201  (via drill 1)
  other vias: 66.04,22.86
N$202  (via drill 1)
  other vias: 68.58,22.86
N$203  (via drill 1)
  other vias: 71.12,22.86
N$204  (via drill 1)
  other vias: 73.66,22.86
N$205  (via drill 1)
  other vias: 76.2,22.86
N$206  (via drill 1)
  other vias: 78.74,22.86
N$207  (via drill 1)
  other vias: 48.26,30.48
N$208  (via drill 1)
  other vias: 50.8,20.32
N$209  (via drill 1)
  other vias: 53.34,20.32
N$210  (via drill 1)
  other vias: 55.88,20.32
N$211  (via drill 1)
  other vias: 58.42,20.32
N$212  (via drill 1)
  other vias: 60.96,20.32
N$213  (via drill 1)
  other vias: 63.5,20.32
N$214  (via drill 1)
  other vias: 66.04,20.32
N$215  (via drill 1)
  other vias: 68.58,20.32
N$216  (via drill 1)
  other vias: 71.12,20.32
N$217  (via drill 1)
  other vias: 73.66,20.32
N$218  (via drill 1)
  other vias: 76.2,20.32
N$219  (via drill 1)
  other vias: 78.74,20.32
N$220  (via drill 1)
  other vias: 50.8,17.78
N$221  (via drill 1)
  other vias: 53.34,17.78
N$222  (via drill 1)
  other vias: 55.88,17.78
N$223  (via drill 1)
  other vias: 58.42,17.78
N$224  (via drill 1)
  other vias: 60.96,17.78
N$225  (via drill 1)
  other vias: 63.5,17.78
N$226  (via drill 1)
  other vias: 66.04,17.78
N$227  (via drill 1)
  other vias: 68.58,17.78
N$228  (via drill 1)
  other vias: 71.12,17.78
N$229  (via drill 1)
  other vias: 73.66,17.78
N$230  (via drill 1)
  other vias: 76.2,17.78
N$231  (via drill 1)
  other vias: 78.74,17.78
N$232  (via drill 1)
  other vias: 53.34,15.24
N$233  (via drill 1)
  other vias: 55.88,15.24
N$234  (via drill 1)
  other vias: 58.42,15.24
N$235  (via drill 1)
  other vias: 60.96,15.24
N$236  (via drill 1)
  other vias: 63.5,15.24
N$237  (via drill 1)
  other vias: 66.04,15.24
N$238  (via drill 1)
  other vias: 68.58,15.24
N$239  (via drill 1)
  other vias: 71.12,15.24
N$240  (via drill 1)
  other vias: 73.66,15.24
N$241  (via drill 1)
  other vias: 76.2,15.24
N$242  (via drill 1)
  other vias: 78.74,15.24
N$243  (via drill 1)
  other vias: 55.88,12.7
N$244  (via drill 1)
  other vias: 58.42,12.7
N$245  (via drill 1)
  other vias: 60.96,12.7
N$246  (via drill 1)
  other vias: 63.5,12.7
N$247  (via drill 1)
  other vias: 66.04,12.7
N$248  (via drill 1)
  other vias: 68.58,12.7
N$249  (via drill 1)
  other vias: 71.12,12.7
N$250  (via drill 1)
  other vias: 73.66,12.7
N$251  (via drill 1)
  other vias: 76.2,12.7
N$252  (via drill 1)
  other vias: 78.74,12.7
N$253  (via drill 1)
  other vias: 58.42,10.16
N$254  (via drill 1)
  other vias: 60.96,10.16
N$255  (via drill 1)
  other vias: 63.5,10.16
N$256  (via drill 1)
  other vias: 66.04,10.16
N$257  (via drill 1)
  other vias: 68.58,10.16
N$258  (via drill 1)
  other vias: 71.12,10.16
N$259  (via drill 1)
  other vias: 73.66,10.16
N$260  (via drill 1)
  other vias: 76.2,10.16
N$261  (via drill 1)
  other vias: 78.74,10.16
N$263  (via drill 1)
  other vias: 63.5,7.62
N$264  (via drill 1)
  other vias: 66.04,7.62
N$265  (via drill 1)
  other vias: 68.58,7.62
N$266  (via drill 1)
  other vias: 71.12,7.62
N$267  (via drill 1)
  other vias: 73.66,7.62
N$268  (via drill 1)
  other vias: 76.2,7.62
N$269  (via drill 1)
  other vias: 78.74,7.62
N$270
  Top 0.25: R1.1 D1.A
N$271
  Top 0.25: R2.1 D2.A
N$272  (via drill 1)
  other vias: 81.28,35.56
N$273  (via drill 1)
  other vias: 81.28,33.02
N$274  (via drill 1)
  other vias: 81.28,30.48
N$275  (via drill 1)
  other vias: 81.28,27.94
N$276  (via drill 1)
  other vias: 81.28,25.4
N$277  (via drill 1)
  other vias: 81.28,22.86
N$278  (via drill 1)
  other vias: 81.28,20.32
N$279  (via drill 1)
  other vias: 38.1,27.94
N$280  (via drill 1)
  other vias: 40.64,27.94
N$281  (via drill 1)
  other vias: 43.18,27.94
N$282  (via drill 1)
  other vias: 45.72,27.94
N$283  (via drill 1)
  other vias: 48.26,27.94
N$284  (via drill 1)
  other vias: 81.28,17.78
N$285  (via drill 1)
  other vias: 81.28,15.24
N$286  (via drill 1)
  other vias: 81.28,12.7
N$287  (via drill 1)
  other vias: 81.28,10.16
N$288  (via drill 1)
  other vias: 81.28,7.62
N$289  (via drill 1)
  other vias: 38.1,25.4
N$290  (via drill 1)
  other vias: 83.82,50.8
N$291  (via drill 1)
  other vias: 83.82,48.26
N$292  (via drill 1)
  other vias: 83.82,45.72
N$293  (via drill 1)
  other vias: 83.82,43.18
N$294  (via drill 1)
  other vias: 83.82,40.64
N$295  (via drill 1)
  other vias: 83.82,38.1
N$296  (via drill 1)
  other vias: 83.82,35.56
N$297  (via drill 1)
  other vias: 83.82,33.02
N$298  (via drill 1)
  other vias: 83.82,30.48
N$299  (via drill 1)
  other vias: 40.64,25.4
N$300  (1 unrouted)
N$301  (via drill 1)
  other vias: 83.82,27.94
N$302  (via drill 1)
  other vias: 83.82,25.4
N$303  (via drill 1)
  other vias: 83.82,22.86
N$304  (via drill 1)
  other vias: 83.82,20.32
N$305  (via drill 1)
  other vias: 83.82,17.78
N$306  (via drill 1)
  other vias: 83.82,15.24
N$307  (via drill 1)
  other vias: 83.82,12.7
N$308  (via drill 1)
  other vias: 83.82,10.16
N$309  (via drill 1)
  other vias: 83.82,7.62
N$310  (via drill 1)
  other vias: 43.18,25.4
N$311  (via drill 1)
  other vias: 86.36,50.8
N$312  (via drill 1)
  other vias: 86.36,48.26
N$313  (via drill 1)
  other vias: 86.36,45.72
N$314  (via drill 1)
  other vias: 86.36,43.18
N$315  (via drill 1)
  other vias: 86.36,40.64
N$316  (via drill 1)
  other vias: 86.36,38.1
N$317  (via drill 1)
  other vias: 86.36,35.56
N$318  (via drill 1)
  other vias: 86.36,33.02
N$319  (via drill 1)
  other vias: 86.36,30.48
N$320  (via drill 1)
  other vias: 86.36,27.94
N$321  (via drill 1)
  other vias: 86.36,25.4
N$322  (via drill 1)
  other vias: 86.36,22.86
N$323  (via drill 1)
  other vias: 86.36,20.32
N$324  (via drill 1)
  other vias: 86.36,17.78
N$325  (via drill 1)
  other vias: 86.36,15.24
N$326  (via drill 1)
  other vias: 86.36,12.7
N$327  (via drill 1)
  other vias: 86.36,10.16
N$328  (via drill 1)
  other vias: 86.36,7.62
N$329  (via drill 1)
  other vias: 45.72,25.4
N$330  (via drill 1)
  other vias: 88.9,50.8
N$331  (via drill 1)
  other vias: 88.9,48.26
N$332  (via drill 1)
  other vias: 88.9,45.72
N$333  (via drill 1)
  other vias: 88.9,43.18
N$334  (via drill 1)
  other vias: 88.9,40.64
N$335  (via drill 1)
  other vias: 88.9,38.1
N$336  (via drill 1)
  other vias: 88.9,35.56
N$337  (via drill 1)
  other vias: 88.9,33.02
N$338  (via drill 1)
  other vias: 88.9,30.48
N$339  (via drill 1)
  other vias: 88.9,27.94
N$340  (via drill 1)
  other vias: 88.9,25.4
N$341  (via drill 1)
  other vias: 88.9,22.86
N$342  (via drill 1)
  other vias: 88.9,20.32
N$343  (via drill 1)
  other vias: 88.9,17.78
N$344  (via drill 1)
  other vias: 88.9,15.24
N$345  (via drill 1)
  other vias: 88.9,12.7
N$346  (via drill 1)
  other vias: 88.9,10.16
N$347  (via drill 1)
  other vias: 88.9,7.62
N$348  (via drill 1)
  other vias: 48.26,25.4
N$349  (via drill 1)
  other vias: 91.44,50.8
N$350  (via drill 1)
  other vias: 91.44,48.26
N$351  (via drill 1)
  other vias: 91.44,45.72
N$352  (via drill 1)
  other vias: 91.44,43.18
N$353  (via drill 1)
  other vias: 91.44,40.64
N$354  (via drill 1)
  other vias: 91.44,38.1
N$355  (via drill 1)
  other vias: 91.44,35.56
N$356  (via drill 1)
  other vias: 91.44,33.02
N$357  (via drill 1)
  other vias: 91.44,30.48
N$358  (via drill 1)
  other vias: 91.44,27.94
N$359  (via drill 1)
  other vias: 91.44,25.4
N$360  (via drill 1)
  other vias: 91.44,22.86
N$361  (via drill 1)
  other vias: 91.44,20.32
N$362  (via drill 1)
  other vias: 91.44,17.78
N$363  (via drill 1)
  other vias: 91.44,15.24
N$364  (via drill 1)
  other vias: 91.44,12.7
N$365  (via drill 1)
  other vias: 91.44,10.16
N$366  (via drill 1)
  other vias: 38.1,22.86
N$367  (via drill 1)
  other vias: 40.64,22.86
N$368  (via drill 1)
  other vias: 43.18,22.86
N$369  (via drill 1)
  other vias: 45.72,22.86
N$370  (via drill 1)
  other vias: 48.26,22.86
N$371  (via drill 1)
  other vias: 38.1,20.32
N$372  (via drill 1)
  other vias: 40.64,20.32
N$373  (via drill 1)
  other vias: 43.18,20.32
N$374  (via drill 1)
  other vias: 45.72,20.32
N$375  (via drill 1)
  other vias: 48.26,20.32
N$376  (via drill 1)
  other vias: 38.1,17.78
N$377  (via drill 1)
  other vias: 40.64,17.78
N$378  (via drill 1)
  other vias: 43.18,17.78
N$379  (via drill 1)
  other vias: 45.72,17.78
N$380  (via drill 1)
  other vias: 48.26,17.78
N$381  (via drill 1)
  other vias: 40.64,15.24
N$382  (via drill 1)
  other vias: 43.18,15.24
N$383  (via drill 1)
  other vias: 45.72,15.24
N$384  (via drill 1)
  other vias: 48.26,15.24
N$386  (via drill 1)
  other vias: 45.72,12.7
N$387  (via drill 1)
  other vias: 48.26,12.7
N$388  (via drill 1)
  other vias: 45.72,10.16
N$389  (via drill 1)
  other vias: 48.26,10.16
N$390  (via drill 1)
  other vias: 35.56,50.8
N$391  (via drill 1)
  other vias: 35.56,48.26
N$392  (via drill 1)
  other vias: 35.56,45.72
N$393  (via drill 1)
  other vias: 45.72,7.62
N$394  (via drill 1)
  other vias: 48.26,7.62
N$395  (via drill 1)
  other vias: 35.56,43.18
N$396  (via drill 1)
  other vias: 35.56,40.64
N$397  (via drill 1)
  other vias: 35.56,38.1
N$398  (via drill 0.25)
  Top 0.152: R29.2 38.3,75.2 39.2,75.2 39.4,75 39.4,72.5 v39.1,72.2 | v42.2,72.1 42.17,72.08 U4.15
  Top 0.5: C4.1 U7.3 38.3,70.3 38.3,75.2
  Bottom 0.152: v42.2,72.1 39.2,72.1 v39.1,72.2
  pour Top (no thermals): 38.8,73.4 38.9,73.4 38.9,76.8 35.7,76.8 35.7,73.4
N$399  (via drill 1)
  other vias: 35.56,58.42
N$400  (via drill 1)
  other vias: 38.1,15.24
N$402  (via drill 1)
  other vias: 53.34,60.96
N$408  (via drill 1)
  other vias: 66.04,60.96
N$409  (via drill 1)
  other vias: 68.58,60.96
N$410  (via drill 1)
  other vias: 71.12,60.96
N$411  (via drill 1)
  other vias: 73.66,60.96
N$412  (via drill 1)
  other vias: 76.2,60.96
N$413  (via drill 1)
  other vias: 78.74,60.96
N$414  (via drill 1)
  other vias: 50.8,58.42
N$415  (via drill 1)
  other vias: 53.34,58.42
N$416  (via drill 1)
  other vias: 35.56,35.56
N$417  (via drill 1)
  other vias: 55.88,58.42
N$418  (via drill 1)
  other vias: 35.56,33.02
N$419  (via drill 1)
  other vias: 58.42,58.42
N$420  (via drill 1)
  other vias: 35.56,30.48
N$421  (via drill 1)
  other vias: 60.96,58.42
N$422  (via drill 1)
  other vias: 35.56,27.94
N$423  (via drill 1)
  other vias: 35.56,25.4
N$424  (via drill 1)
  other vias: 35.56,22.86
N$425  (via drill 1)
  other vias: 35.56,20.32
N$426  (via drill 1)
  other vias: 35.56,17.78
N$427  (via drill 1)
  other vias: 63.5,58.42
N$428  (via drill 1)
  other vias: 66.04,58.42
N$429  (via drill 1)
  other vias: 68.58,58.42
N$430  (via drill 1)
  other vias: 71.12,58.42
N$431  (via drill 1)
  other vias: 73.66,58.42
N$432  (via drill 1)
  other vias: 76.2,58.42
N$433  (via drill 1)
  other vias: 78.74,58.42
N$434  (via drill 1)
  other vias: 50.8,55.88
N$435  (via drill 1)
  other vias: 53.34,55.88
N$436  (via drill 1)
  other vias: 55.88,55.88
N$437  (via drill 1)
  other vias: 58.42,55.88
N$438  (via drill 1)
  other vias: 60.96,55.88
N$439  (via drill 1)
  other vias: 63.5,55.88
N$440  (via drill 1)
  other vias: 66.04,55.88
N$441  (via drill 1)
  other vias: 68.58,55.88
N$442  (via drill 1)
  other vias: 71.12,55.88
N$443  (via drill 1)
  other vias: 73.66,55.88
N$444  (via drill 1)
  other vias: 76.2,55.88
N$445  (via drill 1)
  other vias: 78.74,55.88
N$446  (via drill 1)
  other vias: 50.8,53.34
N$447  (via drill 1)
  other vias: 53.34,53.34
N$448  (via drill 1)
  other vias: 55.88,53.34
N$449  (via drill 1)
  other vias: 58.42,53.34
N$450  (via drill 1)
  other vias: 60.96,53.34
N$451  (via drill 1)
  other vias: 63.5,53.34
N$452  (via drill 1)
  other vias: 66.04,53.34
N$453  (via drill 1)
  other vias: 68.58,53.34
N$454  (via drill 1)
  other vias: 71.12,53.34
N$455  (via drill 1)
  other vias: 73.66,53.34
N$456  (via drill 1)
  other vias: 76.2,53.34
N$457  (via drill 1)
  other vias: 78.74,53.34
N$458  (via drill 1)
  other vias: 81.28,60.96
N$459  (via drill 1)
  other vias: 81.28,58.42
N$460  (via drill 1)
  other vias: 81.28,55.88
N$461  (via drill 1)
  other vias: 81.28,53.34
N$462  (via drill 1)
  other vias: 83.82,60.96
N$463  (via drill 1)
  other vias: 83.82,58.42
N$464  (via drill 1)
  other vias: 83.82,55.88
N$465  (via drill 1)
  other vias: 83.82,53.34
N$466  (via drill 1)
  other vias: 86.36,60.96
N$467  (via drill 1)
  other vias: 86.36,58.42
N$468  (via drill 1)
  other vias: 86.36,55.88
N$469  (via drill 1)
  other vias: 86.36,53.34
N$470  (via drill 1)
  other vias: 88.9,60.96
N$471  (via drill 1)
  other vias: 88.9,58.42
N$472  (via drill 1)
  other vias: 88.9,55.88
N$473  (via drill 1)
  other vias: 88.9,53.34
N$474  (via drill 1)
  other vias: 91.44,60.96
N$475  (via drill 1)
  other vias: 91.44,58.42
N$476  (via drill 1)
  other vias: 91.44,55.88
N$477  (via drill 1)
  other vias: 91.44,53.34
N$478  (via drill 1)
  other vias: 33.02,58.42
N$479  (via drill 1)
  other vias: 35.56,15.24
N$480
  Top 0.2: U3.8 54.04,67.84 53.6,67.4 TP2.1
N$481  (via drill 1)
  other vias: 35.56,55.88
N$482
  Top 0.2: TP3.1 53.9,66.7 54.5,66.7 54.92,67.12 U3.9
N$483  (via drill 1)
  other vias: 38.1,58.42
N$484  (via drill 1)
  other vias: 40.64,58.42
N$485  (via drill 1)
  other vias: 43.18,58.42
N$486  (via drill 1)
  other vias: 45.72,58.42
N$487  (via drill 1)
  other vias: 48.26,58.42
N$488  (via drill 1)
  other vias: 38.1,55.88
N$489  (via drill 1)
  other vias: 40.64,55.88
N$490  (via drill 1)
  other vias: 43.18,55.88
N$491  (via drill 1)
  other vias: 45.72,55.88
N$492  (via drill 1)
  other vias: 48.26,55.88
N$493  (via drill 1)
  other vias: 38.1,53.34
N$494  (via drill 1)
  other vias: 40.64,53.34
N$495  (via drill 1)
  other vias: 43.18,53.34
N$496  (via drill 1)
  other vias: 45.72,53.34
N$497  (via drill 1)
  other vias: 48.26,53.34
N$501  (via drill 1)
  other vias: 76.2,66.04
N$502  (via drill 1)
  other vias: 78.74,66.04
N$505  (via drill 1)
  other vias: 73.66,63.5
N$506  (via drill 1)
  other vias: 76.2,63.5
N$507  (via drill 1)
  other vias: 78.74,63.5
N$508  (via drill 1)
  other vias: 81.28,66.04
N$509  (via drill 1)
  other vias: 81.28,63.5
N$510  (via drill 1)
  other vias: 83.82,66.04
N$511  (via drill 1)
  other vias: 83.82,63.5
N$512  (via drill 1)
  other vias: 86.36,66.04
N$513  (via drill 1)
  other vias: 86.36,63.5
N$514  (via drill 1)
  other vias: 88.9,66.04
N$515  (via drill 1)
  other vias: 88.9,63.5
N$516  (via drill 1)
  other vias: 91.44,66.04
N$517  (via drill 1)
  other vias: 91.44,63.5
N$518
  Top 0.2: U3.10 55.58,66.67 TP4.1
N$521  (via drill 1)
  other vias: 76.2,76.2
N$522  (via drill 1)
  other vias: 78.74,76.2
N$523
  Top 0.2: U3.11 56.23,65.62 TP5.1
N$526  (via drill 1)
  other vias: 76.2,73.66
N$527  (via drill 1)
  other vias: 78.74,73.66
N$531  (via drill 1)
  other vias: 76.2,71.12
N$532  (via drill 1)
  other vias: 78.74,71.12
N$536  (via drill 1)
  other vias: 76.2,68.58
N$537  (via drill 1)
  other vias: 78.74,68.58
N$538  (via drill 1)
  other vias: 81.28,76.2
N$539  (via drill 1)
  other vias: 81.28,73.66
N$540  (via drill 1)
  other vias: 81.28,71.12
N$541  (via drill 1)
  other vias: 81.28,68.58
N$542  (via drill 1)
  other vias: 83.82,76.2
N$543  (via drill 1)
  other vias: 83.82,73.66
N$544  (via drill 1)
  other vias: 83.82,71.12
N$545  (via drill 1)
  other vias: 83.82,68.58
N$546  (via drill 1)
  other vias: 86.36,76.2
N$547  (via drill 1)
  other vias: 86.36,73.66
N$548  (via drill 1)
  other vias: 86.36,71.12
N$549  (via drill 1)
  other vias: 86.36,68.58
N$550  (via drill 1)
  other vias: 88.9,76.2
N$551  (via drill 1)
  other vias: 88.9,73.66
N$552  (via drill 1)
  other vias: 88.9,71.12
N$553  (via drill 1)
  other vias: 88.9,68.58
N$554  (via drill 1)
  other vias: 91.44,76.2
N$555  (via drill 1)
  other vias: 91.44,73.66
N$556  (via drill 1)
  other vias: 91.44,71.12
N$557  (via drill 1)
  other vias: 91.44,68.58
N$558  (via drill 1)
  other vias: 35.56,53.34
N$559  (via drill 1)
  other vias: 33.02,50.8
N$560  (via drill 1)
  other vias: 33.02,48.26
N$561  (via drill 1)
  other vias: 33.02,45.72
N$562  (via drill 1)
  other vias: 33.02,43.18
N$563  (via drill 1)
  other vias: 33.02,40.64
N$564  (via drill 1)
  other vias: 33.02,38.1
N$565  (via drill 1)
  other vias: 33.02,35.56
N$566  (via drill 1)
  other vias: 33.02,33.02
N$567  (via drill 1)
  other vias: 33.02,30.48
N$568  (via drill 1)
  other vias: 33.02,27.94
N$569  (via drill 1)
  other vias: 33.02,25.4
N$570  (via drill 1)
  other vias: 33.02,22.86
N$571  (via drill 1)
  other vias: 33.02,20.32
N$572  (via drill 1)
  other vias: 33.02,17.78
N$573
  Top 0.2: U3.12 56.88,66.12 TP10.1 57.9,64.9 R12.2
N$574  (via drill 1)
  other vias: 33.02,15.24
N$575
  Top 0.2: R12.1 60.5,64.08 D4.A
N$576  (via drill 1)
  other vias: 33.02,55.88
N$577  (via drill 1)
  other vias: 33.02,53.34
N$579  (via drill 0.35)
  Top 0.152: v62.83,73.17 62.83,72.95 62.23,72.35 60.75,72.35 60.5,72.1 R25.2
  Top 0.2: v63.5,69.5 Q1.5 65.38,69.5 66,68.88 66,68.5 66.53,67.97 C6.1
  Bottom 0.2: v62.83,73.17 62.83,70.17 v63.5,69.5
N$580
  Top 0.2: R15.2 C6.2 67.53,67.35 67.38,67.5 Q1.1 66.7,68.55 66.4,68.85 66.4,69.3 65.25,70.45 Q1.4
N$581  (via drill 0.35)
  Top 0.2: R18.1 C8.2 65.22,67.45 R16.2 65.81,67.47 v65.91,67.57 | v66.5,71.5 67,71.5 67.38,71.12 Q1.3
  Bottom 0.2: v65.91,67.57 65.91,70.91 v66.5,71.5
N$589
  Top 0.2: U3.13 57.8,68.69 R26.1
N$590
  Top 0.2: Q5.3 46.66,73.74 46.4,74 | 46.4,74 R27.1 | Q4.3 46.2,73.8 46.4,74
N$593
  Top 0.152: R29.1 40,75.2 39.8,75 39.8,72.5 41.52,70.78 U4.16
  pour Top (no thermals): 44.3,76.8 44.3,73.2 40.3,73.2 40.3,76.8
N$596
  Top 0.2: R31.1 45.8,70.4 TP12.1 46.94,69.26 46.94,68.37 48,67.31 48,66.2 47,65.2 45.7,65.2 R32.2 45.33,66.35 45.1,66.58 U4.10
N$597  (via drill 0.35)
  Top 0.2: U4.11 45.12,67.22 45.3,67.4 R34.2 45.7,67.94 v46.1,68.35 | R33.1 47.4,64.4 | 47.4,64.4 48.1,65.1 v48.1,65.4 | 47.4,64.4 48.17,63.62 TP11.1
  Bottom 0.2: v48.1,65.4 46.6,65.4 46.1,65.89 v46.1,68.35
N$598
  Top 0.2: U4.14 42.83,69.72 43,69.9 R31.2
N$599  (via drill 0.25)
  Top 0.2: R33.2 v45,64.4 | U4.12 45.08,67.88 45.2,68 v45.2,68.4 | 43.48,64.22 43.7,64 44.6,64 v45,64.4 | v45,64.4 45.2,64.6 45.2,65.8 45.08,65.92 U4.9
  Bottom 0.2: v45.2,68.4 45.2,65.1 45,64.9 v45,64.4
N$600
  Top 0.2: U4.13 44.26,68.76 TP6.1
N$603
  Top 0.2: R37.2 C2.1 R36.2
N$604  (via drill 0.25)
  Top 0.2: U4.5 40.74,65.04 v40.7,65 | v39.3,64.9 R37.1
  Bottom 0.2: v40.7,65 40,65 39.9,64.9 v39.3,64.9
ON/!OFF
  Top 0.2: U3.4 52.94,71.56 52.5,72 TP13.1 51,72 50.8,72.2 R28.2 48.99,72.2 Q5.1
OPD_PWR
  Top 0.5: J6.19 50.53,90.33 52.8,92.6 64.1,92.6 66.2,90.5 66.2,73.8 61.6,69.2 61.6,68.1 61.2,67.7 R4.1
  Bottom 0.25: J6.19 J6.20
OPD_SCL
  Top 0.25: R24.1 62.23,70.72 65.5,74 65.5,90.27 63.87,91.9 53.4,91.9 51.8,90.31 J6.17
  Bottom 0.25: J6.17 J6.18
OPD_SDA
  Top 0.25: J6.15 53.08,90.8 53.67,91.4 63.6,91.4 65,90 65,74.3 62.3,71.6 R25.1
  Bottom 0.25: J6.15 J6.16
PEN-SCL-FILT  (via drill 0.25)
  Top 0.2: U3.15 58.98,70.03 v59.67,70.72 R24.2 | v61.5,76.1 R6.1 | v57.7,76.1 R13.1 | v53.8,76.1 R21.1
  Bottom 0.2: v59.67,70.72 60.23,70.72 62.1,72.6 62.1,75.5 v61.5,76.1 v57.7,76.1 v53.8,76.1 TP18.1
PEN-SDA-FILT  (via drill 0.25, 0.35)
  Top 0.2: v57.7,73 R19.2 | v53.8,73 R23.2 | TP20.1 63.4,74.8 62.7,74.1 R9.2 v61.5,73 60.62,73 58.3,70.67 U3.16 | Q1.6 v63.42,68.55 63.42,67.72 63.67,67.47 R16.1
  Bottom 0.2: v53.8,73 54.7,73.8 56.9,73.8 v57.7,73 58.4,73.7 58.4,73.8 60.7,73.8 v61.5,73 60.94,73 58.96,71.03 58.96,70.41 59.38,69.99 60.94,69.99 62.38,68.55 v63.42,68.55
RF1  (1 unrouted)
RF2  (1 unrouted)
SPARE1
  Bottom 0.25: J6.13 J6.14 54.34,83.25 54.6,83 54.6,80.02 JP11.8
SPARE2
  Bottom 0.25: J6.11 J6.12 55.62,83.89 55.9,83.6 55.9,81.3 JP11.7
SPARE3
  Bottom 0.25: J6.9 J6.10 56.88,82.31 57.2,82 57.2,79.96 JP11.6
SPARE4
  Bottom 0.25: J6.7 J6.8 58.16,81.55 JP11.5
SPARE5
  Bottom 0.25: J6.5 J6.6 59.42,82.28 59.7,82 59.7,80 JP11.4
SPARE6
  Bottom 0.25: J6.3 J6.4 60.7,82.81 61,82.5 61,81.32 JP11.3
SPARE7
  Bottom 0.25: J6.1 J6.2 61.97,82.23 62.3,81.9 62.3,79.94 JP11.2
TPS62111-PG
  Top 0.2: U5.13 27.82,68.12 27.4,67.7 TP16.1
TPS62111-SYNC  (via drill 0.25)
  Top 0.2: U5.5 31.48,72.08 v31.5,72.1 | R10.2 TP19.1 R7.1
  Bottom 0.2: v31.5,72.1 31.5,75.1 TP19.1
TPS62111_SW
  pour Top (no thermals): 29.9,68.4 29.3,68.4 29.3,66.2 29.9,66.2
VBUS
  Bottom 0.5: J6.27 J6.28 | JP10.3 JP10.4 | JP10.1 JP10.2
  pour Top (isolate 0.2, no thermals): 48,80.53 48,81.93 46.8,83.03 46.8,90.9 44.6,90.9 44.6,83.13 43.5,82.23 43.5,80.53
  pour Top (isolate 0.2, no thermals): 43.5,79.63 43.5,78.23 44.7,77.13 44.7,75.34 46.9,75.34 46.9,77.03 48,77.93 48,79.63
VBUSP  (via drill 0.25)  (12 unrouted)
  Top 0.2: C2.2 v36.5,64.8 | R7.2 30.1,74.2 | R1.2 v21.4,15
  Top 0.7: JP1.5 40.64,7.96 37.8,10.8 29.6,10.8 28.2,12.2 v28.2,14.4 v27.6,15
  Bottom 0.7: TP9.1 32.5,72.1 37.2,67.4 37.2,65.5 v36.5,64.8 34.9,64.8 32.5,62.4 28.7,62.4 22.9,56.6 22.9,43.14 JP3.3 JP3.2 JP3.1 25.4,33.9 20.3,28.8 20.3,25.53 | v28.2,14.4 v27.6,15 v21.4,15 20.27,16.13
  pour Top (no thermals): 35.3,71.4 35.3,74.8 28.2,74.8 28.2,71.8 31.3,71.8 31.3,69.7 34.5,69.7 34.5,71.4
VPD  (via drill 0.25, 0.35)
  Top 0.2: R26.2 R4.2 60.2,66.05 60.52,65.72 R18.2 C8.1 v63,66.6 | v58.6,73 R5.2 | v54.7,73 R11.2 | R20.2 v50.9,73 | R38.2 v49.4,67.9 | Q1.2 v68.5,69.5
  Top 0.3: U3.14 59.27,69.38 C1.2
  Top 0.4: R4.2 60.2,67.7 60.6,68.1 TP1.1 60.23,69.38 59.27,69.38
  Bottom 0.2: TP1.1 59.8,69 58.6,70.2 v58.6,73 58,72.4 55.3,72.4 v54.7,73 54,72.3 53.5,72.3 52.8,73 v50.9,73 50.9,70.94 50.91,70.93 50.91,69.2 49.6,67.9 v49.4,67.9 | v68.5,69.5 68.5,67.22 68.2,66.92 65.42,66.92 64.97,67.38 63.5,67.38 63,66.88 v63,66.6

## Text on the board
tPlace: C2L | 2 | 4 | 6 | 10 | 9 | 8 | 7 | 6 | 5 | 4 | 3 | 2 | 1 | C2H | 1 | 3 | 5 | 7 | PB7/SD | PA0 | PB6/CL | PA1 | PB5 | PA2/TX | PB4 | PA3/RX | PB3 | PA4 | PA15 | PA5 | +3.3V | PA8 | PA6 | GND | PA7 | GND | PB0 | PB1 | VBUS | FTDI VUSB / to VBUS | +3.3V | OreSat Proto-Card v3.1 | 2019/02/20 | PA0 | VBUSP | 3.3V | CAN1H | CAN1L | !SHDN | 3.3V | VBUS